# Altium project 9v to -5v.PrjPcb
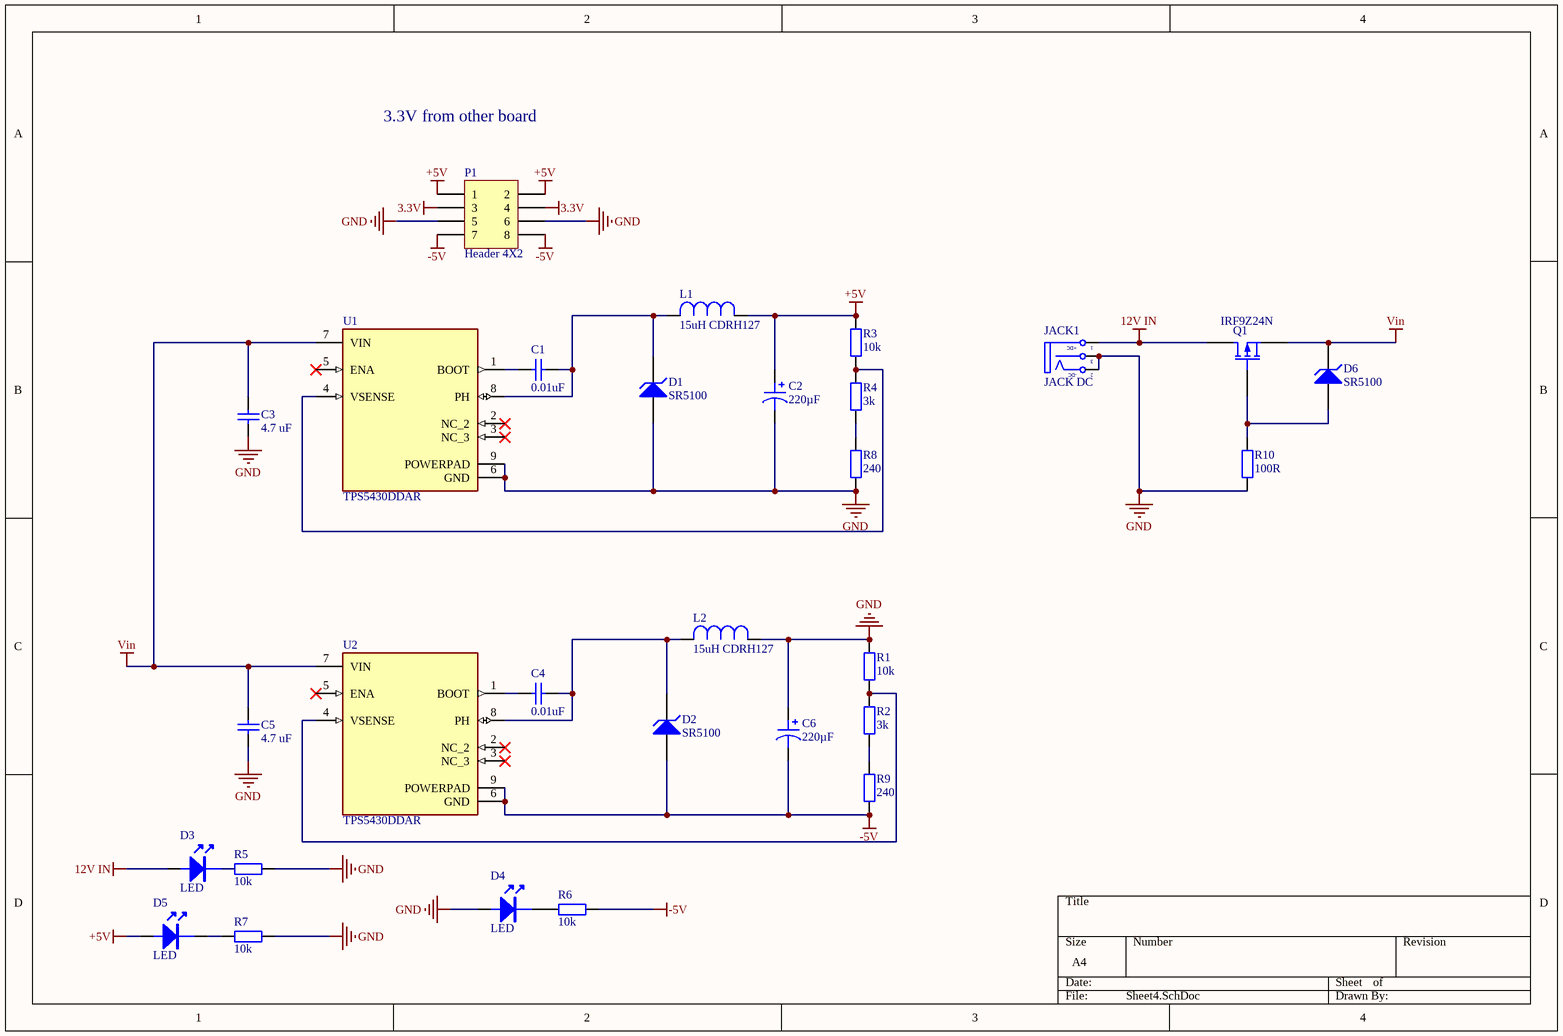
[diagram p0: Sheet4.SchDoc]
1 sheet, 29 parts. Net scope: global (net labels, ports and power ports of the same name join across sheets).
Board files: PCB1.PcbDoc, PCB2.PcbDoc

## Sheet Sheet4.SchDoc
size A4

### Parts
C1  0.01uF  [0805 CAP]
C2  220µF  [CAP POL 2917_7343]
C3  4.7 uF  [0805 CAP]
C4  0.01uF  [0805 CAP]
C5  4.7 uF  [0805 CAP]
C6  220µF  [CAP POL 2917_7343]
D1  SR5100  [DIODE-0.4]
D2  SR5100  [DIODE-0.4]
D3  LED  [LED SMD 0805]
D4  LED  [LED SMD 0805]
D5  LED  [LED SMD 0805]
D6  SR5100  [DIODE-0.4]
JACK1  JACK DC  [JACK DC]
L1  15uH CDRH127  [IND_CDRH127/LDNP-470MC_SUM]
L2  15uH CDRH127  [IND_CDRH127/LDNP-470MC_SUM]
P1  Header 4X2  [HDR2X4]
Q1  IRF9Z24N  [TO-220AB]
R1  10k  [0805 RESISTOR]
R2  3k  [0805 RESISTOR]
R3  10k  [0805 RESISTOR]
R4  3k  [0805 RESISTOR]
R5  10k  [0805 RESISTOR]
R6  10k  [0805 RESISTOR]
R7  10k  [0805 RESISTOR]
R8  240  [0805 RESISTOR]
R9  240  [0805 RESISTOR]
R10  100R  [0805 RESISTOR]
U1  TPS5430DDAR  [CONV_TPS5430DDAR]
U2  TPS5430DDAR  [CONV_TPS5430DDAR]

### Nets
3.3V: P1.3 P1.4
12V IN: D3.1 JACK1.1(T) Q1.1(D)
+5V: C2.1 D5.1 L1.1 P1.1 P1.2 R3.2
-5V: C6.2 D2.1(A) P1.7 P1.8 R6.2 R9.1 U2.6(GND) U2.9(POWERPAD)
GND: C2.2 C3.1 C5.1 C6.1 D1.1(A) D4.1 JACK1.2(TN) JACK1.3(S) L2.1 P1.5 P1.6 R1.2 R5.2 R7.2 R8.1 R10.1 U1.6(GND) U1.9(POWERPAD)
Vin: C3.2 C5.2 D6.2(K) Q1.3(S) U1.7(VIN) U2.7(VIN)
NetC1_1: C1.1 U1.1(BOOT)
NetC1_2: C1.2 D1.2(K) L1.2 U1.8(PH)
NetC4_1: C4.1 U2.1(BOOT)
NetC4_2: C4.2 D2.2(K) L2.2 U2.8(PH)
NetD3_2: D3.2 R5.1
NetD4_2: D4.2 R6.1
NetD5_2: D5.2 R7.1
NetD6_1: D6.1(A) Q1.2(G) R10.2
NetR1_1: R1.1 R2.2 U2.4(VSENSE)
NetR2_1: R2.1 R9.2
NetR3_1: R3.1 R4.2 U1.4(VSENSE)
NetR4_1: R4.1 R8.2

Not connected (* = marked no-connect by the designer): U1 2(NC_2)* 3(NC_3)* 5(ENA)*; U2 2(NC_2)* 3(NC_3)* 5(ENA)*

### Notes on the sheet
- 3.3V from other board
- (in symbol JACK DC) +DC; -DC

### Library data of the parts
C1 C3-C5 = CAP CERAMIC: Published: 8-Jun-2000; LatestRevisionDate: 17-Jul-2002; LatestRevisionNote: Re-released for DXP Platform.; PackageReference: RAD-0.3; Publisher: Altium Limited
C2 C6 = TPSE337M010R0040: CAP TANT 330UF 20% 10V 2917; Manufacturer: AVX Corporation; Manufacturer Size Code: E; Capacitance: 330µF; ESR (Equivalent Series Resistance): 40mOhm; Type: Molded; Part Number: TPSE337M010R0040; Value: 220µF; ComponentLink1Description: Datasheet; ComponentLink1URL: http://datasheets.avx.com/TPS.pdf; ComponentLink2Description: DigiKey Link; ComponentLink2URL: http://digikey.com/product-detail/en/avx-corporation/TPSE337M010R0040/478-9244-1-ND/4562109; Device Package: 2917 (7343 Metric); Features: General Purpose; Height - Seated (Max): 0.169" (4.30mm); LastUpdated: 9/2/2020 1:16:10 AM; Lifecycle Status: Active; Minimum Order: 1; Mounting Type: Surface Mount; Operating Temperature: -55°C ~ 125°C; Package / Case: 2917 (7343 Metric); Packaging: TapeAndReel; PartId: 3489; Part Status: Active; Price: 1.73; Series: TPS; Size / Dimension: 0.287" L x 0.169" W (7.30mm x 4.30mm); Supplier 1: DigiKey; Supplier Part Number 1: 478-9244-1-ND; Tolerance: ±20%; Voltage - Rated: 10V
D1 D2 D6 = D Zener: Zener Diode; Published: 8-Jun-2000; LatestRevisionDate: 17-Jul-2002; LatestRevisionNote: Re-released for DXP Platform.; PackageReference: DIODE-0.7; Publisher: Altium Limited; PackageDescription: Diode, Thru-Hole; 2 Leads; 0.7 in Pin Spacing
JACK1 = JACK DC: Value: Jac DC
L1 L2 = CDRH127/LDNP-470MC: 47ÂµH Shielded Inductor 3.25A 78mOhm Max Nonstandard; MF: Sumida America; Digi-Key_Part_Number: 308-1339-1-ND; Check_prices: https://www.snapeda.com/parts/CDRH127/LDNP-470MC/Sumida%20America%20Components%20Inc./view-part/547921/?ref=eda; Package: Nonstandard Sumida; Value: *; MP: CDRH127/LDNP-470MC; SnapEDA_Link: https://www.snapeda.com/parts/CDRH127/LDNP-470MC/Sumida%20America%20Components%20Inc./view-part/547921/?ref=snap; Purchase-URL: https://pricing.snapeda.com/search/part/CDRH127/LDNP-470MC/?ref=eda
Q1 = MOSFET-P: P-Channel MOSFET; Published: 8-Jun-2000; LatestRevisionDate: 17-Jul-2002; LatestRevisionNote: Re-released for DXP Platform.; PackageVersion: 1995/1996; PackageReference: E3; Publisher: Altium Limited; PackageDescription: TO, Flat Index; 3 In-Line, Axial Leads; Body Dia. 4.6mm; Lead Dia. 0.5 mm (max)
R1-R10 = RESISTOR: Value: R1/4W - 1K
U1 U2 = TPS5430DDAR: 5.5V to 36V Input, 3A, 500kHz Step-Down Converter 8-SO PowerPAD -40 to 125; MF: Texas Instruments; Texas_Instruments-Purchase-URL: https://snapeda.com/shop?store=Texas+Instruments&id=423058; Value: *; Arrow_Electronics-Purchase-URL: https://snapeda.com/shop?store=Arrow+Electronics&id=423058; MP: TPS5430DDAR; DigiKey-Purchase-URL: https://snapeda.com/shop?store=DigiKey&id=423058; Package: HSOIC-8 Texas Instruments; SnapEDA_Link: https://www.snapeda.com/parts/TPS5430DDAR/Texas%20Instruments/view-part/423058/?ref=snap; Mouser-Purchase-URL: https://snapeda.com/shop?store=Mouser&id=423058; Digi-Key_Part_Number: 296-26988-1-ND
P1 = Header 4X2: LatestRevisionDate: 17-Jul-2002; LatestRevisionNote: Re-released for DXP Platform.; Publisher: Altium Limited